# Altium schematic sheet PROCESSOR.SchDoc
size A
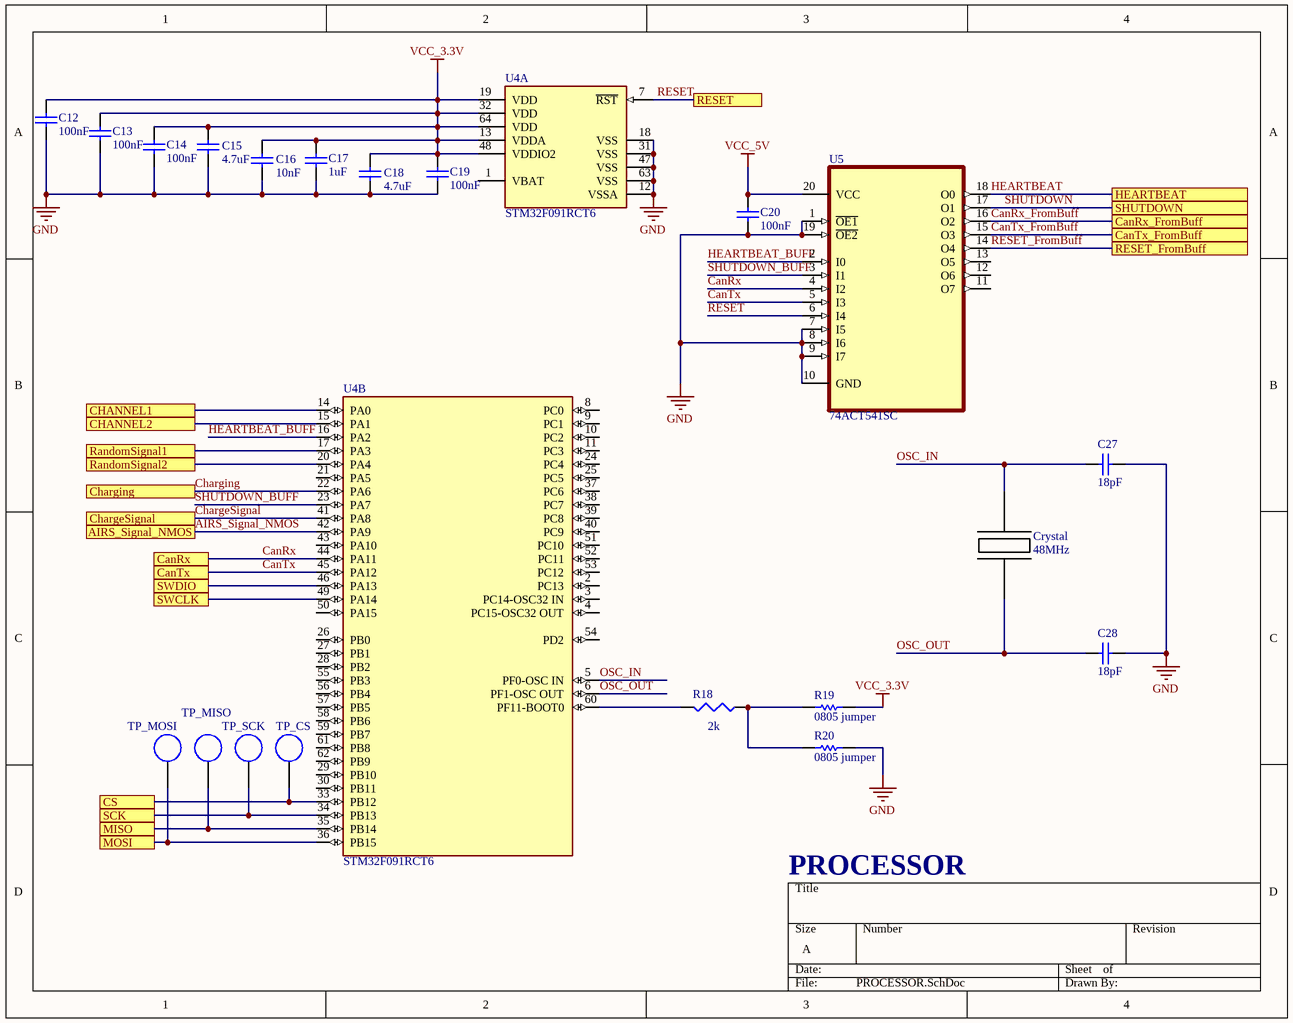
[diagram p0: PROCESSOR.SchDoc]

## Parts
C12  100nF  [Cap, 5mm TH, Ceramic]
C13  100nF  [Cap, 5mm TH, Ceramic]
C14  100nF  [Cap, 5mm TH, Ceramic]
C15  4.7uF  [Cap, 5mm TH, Ceramic]
C16  10nF  [Cap, 5mm TH, Ceramic]
C17  1uF  [Cap, 5mm TH, Ceramic]
C18  4.7uF  [Cap, 5mm TH, Ceramic]
C19  100nF  [Cap, 5mm TH, Ceramic]
C20  100nF  [Cap, 5mm TH, Ceramic]
C27  18pF  [Cap, 5mm TH, Ceramic]
C28  18pF  [Cap, 5mm TH, Ceramic]
Crystal  48MHz  [CrystalOscillator]
R18  2k  [1/4W TH Resistor]
R19  0805 jumper  [RESC2013X60X35LL20T20]
R20  0805 jumper  [RESC2013X60X35LL20T20]
TP_CS  5015  [5015]  (value not drawn)
TP_MISO  5015  [5015]  (value not drawn)
TP_MOSI  5015  [5015]  (value not drawn)
TP_SCK  5015  [5015]  (value not drawn)
U4  STM32F091RCT6  [FP-LQFP64-5W-MFG]  (parts A,B of 2)
U5  74ACT541SC  [SOIC127P1032X265-20N]

## Ports
AIRS_Signal_NMOS, CanRx, CanRx_FromBuff, CanTx, CanTx_FromBuff, CHANNEL1, CHANNEL2, ChargeSignal, Charging, CS, HEARTBEAT, MISO, MOSI, RandomSignal1, RandomSignal2, RESET, RESET_FromBuff, SCK, SHUTDOWN, SWCLK, SWDIO

## Nets
GND: C12.1(Pos) C13.1(Pos) C14.1(Pos) C15.1(Pos) C16.1(Pos) C17.1(Pos) C18.1(Pos) C19.1(Pos) C20.1(Pos) C27.1(Pos) C28.1(Pos) R20.1 U4.12(VSSA) U4.18(VSS) U4.31(VSS) U4.47(VSS) U4.63(VSS) U5.1(~{OE1}) U5.7(I5) U5.8(I6) U5.9(I7) U5.10(GND) U5.19(~{OE2})
VCC_3.3V: C12.2(Neg) C13.2(Neg) C14.2(Neg) C15.2(Neg) C16.2(Neg) C17.2(Neg) C18.2(Neg) C19.2(Neg) R19.2 U4.13(VDDA) U4.19(VDD) U4.32(VDD) U4.48(VDDIO2) U4.64(VDD)
VCC_5V: C20.2(Neg) U5.20(VCC)
AIRS_Signal_NMOS: U4.42(PA9) ; port AIRS_Signal_NMOS
CanRx: U4.44(PA11) U5.4(I2) ; port CanRx
CanRx_FromBuff: U5.16(O2) ; port CanRx_FromBuff
CanTx: U4.45(PA12) U5.5(I3) ; port CanTx
CanTx_FromBuff: U5.15(O3) ; port CanTx_FromBuff
CHANNEL1: U4.14(PA0) ; port CHANNEL1
CHANNEL2: U4.15(PA1) ; port CHANNEL2
ChargeSignal: U4.41(PA8) ; port ChargeSignal
Charging: U4.22(PA6) ; port Charging
CS: TP_CS.1 U4.33(PB12) ; port CS
HEARTBEAT: U5.18(O0) ; port HEARTBEAT
HEARTBEAT_BUFF: U4.16(PA2) U5.2(I0)
MISO: TP_MISO.1 U4.35(PB14) ; port MISO
MOSI: TP_MOSI.1 U4.36(PB15) ; port MOSI
OSC_IN: C27.2(Neg) Crystal.2 U4.5(PF0-OSC_IN)
OSC_OUT: C28.2(Neg) Crystal.1 U4.6(PF1-OSC_OUT)
RandomSignal1: U4.17(PA3) ; port RandomSignal1
RandomSignal2: U4.20(PA4) ; port RandomSignal2
RESET: U4.7(~{RST}) U5.6(I4) ; port RESET
RESET_FromBuff: U5.14(O4) ; port RESET_FromBuff
SCK: TP_SCK.1 U4.34(PB13) ; port SCK
SHUTDOWN: U5.17(O1) ; port SHUTDOWN
SHUTDOWN_BUFF: U4.23(PA7) U5.3(I1)
SWCLK: U4.49(PA14) ; port SWCLK
SWDIO: U4.46(PA13) ; port SWDIO
NetR18_1: R18.1 R19.1 R20.2
NetR18_2: R18.2 U4.60(PF11-BOOT0)

Not connected (* = marked no-connect by the designer): U4 1(VBAT) 2(PC13) 3(PC14-OSC32_IN) 4(PC15-OSC32_OUT) 8(PC0) 9(PC1) 10(PC2) 11(PC3) 21(PA5) 24(PC4) 25(PC5) 26(PB0) 27(PB1) 28(PB2) 29(PB10) 30(PB11) 37(PC6) 38(PC7) 39(PC8) 40(PC9) 43(PA10) 50(PA15) 51(PC10) 52(PC11) 53(PC12) 54(PD2) 55(PB3) 56(PB4) 57(PB5) 58(PB6) 59(PB7) 61(PB8) 62(PB9); U5 11(O7) 12(O6) 13(O5)

## Notes on the sheet
- PROCESSOR

## Library data of the parts
C12-C20 C27 C28 = Cap, 5MM TH, Ceramic: Generic Cap, 5MM TH, Ceramic; TargetLibrary: RITRacing-Passives; Value: Value?; Publisher: T.Tallo; Published: 22Oct2016; Status: Active
Crystal = CrystalOscillator
R18 = Resistor, TH: Generic TH Resistor; TargetLibrary: RITRacing-Passives; Value: Value?; Publisher: T.Tallo; Published: 22Oct2016; Status: Active
R19 R20 = CMP-2000-06973-1: Chip Resistor, 0 Ohm, +/- 5%, 0.125 W, -55 to 155 degC, 0805 (2012 Metric) , RoHS, Tape and Reel; Manufacturer: Samsung Electro-Mechanics; Resistance: 0O; Temp Coefficient: ±200ppm/°C; Rated Power: 0.125W; Mounting Technology: SurfaceMount; Tolerance (%): ±5%; Package Reference: 0805; Size Code: 0805; Package Description: 2-Pin Chip Resistor, Body 2 x 1.25 mm; Manufacturer URL: http://www.samsungsem.com/global/index.jsp; Datasheet URL: https://datasheet.ciiva.com/15196/getdatasheetpartid-499011-15196236.pdf; Datasheet Version: 11/2010
TP_CS TP_MISO TP_MOSI TP_SCK = 5015: SMD Test Point; Manufacturer: Keystone Electronics; TargetLibrary: RITRacing-Connectors; PartNumber: 5015; Publisher: T.Tallo; Published: 22Oct2016; Status: Active; ComponentLink1URL: http://www.mouser.com/ds/2/215/005-5009-743680.pdf; ComponentLink1Description: Datasheet
U4 = CMP-12105-000069-1: IC MCU 32BIT 256KB FLASH 64LQFP; Manufacturer: STMicroelectronics; Ram Size: 32KBytes; Number Of A/D Converters: 1; Standoff Height: 0.05mm; Number Of I/Os: 52; Number Of Pwm Channels: 6; Max Supply Voltage: 3.6V; Data Bus Width: 32bits; Max Junction Temp: +105°C; Number Of Spi Channels: 2; Min Supply Voltage: 2V; Number Of Adc Channels: 19; Memory Size: 256KBytes; Frequency: 48MHz; Nominal Supply Current: 0.9-26.9mA; Number Of Uart Channels: 8; Core Architecture: ARM Cortex-M0; Number Of Timers/Counters: 10; Interface: I2C,SPI,USART,CAN,LIN,IrDA,I2S,SMBus; Category: IC; Digikey Description: IC MCU 32BIT 256KB FLASH 64LQFP; Temperature Range Low: -40°C; Lead Free: Yes; ComponentLink2Description: Datasheet; Octopart: https://octopart.com/stm32f091rct6-stmicroelectronics-51988683; Device Class L1: Integrated Circuits (ICs); Automotive: No; Temperature Range High: +85°C; Ambient Temperature Range Low: -40°C; Device Class L2: Embedded Processors and Controllers; Number Of I2C Channels: 2; Memory Type: FLASH; Device Class L3: Microcontrollers; Height: 1.6mm; Temperature: -40°C to +85°C; Ambient Temperature Range High: +85°C; RoHS: TRUE; Ipc Land Pattern Name: QFP50P1200X1200X160-64; ComponentLink2URL: https://www.st.com/resource/en/datasheet/stm32f091rc.pdf; Manufacturer Part Number: STM32F091RCT6; Package: LQFP64-5W; Mouser Description: ARM Microcontrollers - MCU 16/32-BITS MICROS; Number Of Cores: 1
U5 = 74ACT541SC: Buffer, Non-Inverting 1 Element 8 Bit per Element 3-State Output 20-SOIC; MF: ON Semiconductor; DigiKey-Purchase-URL: https://snapeda.com/shop?store=DigiKey&id=431052; Mouser-Purchase-URL: https://snapeda.com/shop?store=Mouser&id=431052; SnapEDA_Link: https://www.snapeda.com/parts/74ACT541SC/ON%20Semiconductor/view-part/431052/?ref=snap; Price: None; Arrow_Electronics-Purchase-URL: https://snapeda.com/shop?store=Arrow+Electronics&id=431052; MP: 74ACT541SC; Value: *; Availability: Warning; Package: SOIC-20 Fairchild Semiconductor